# Altium schematic sheet datalogger.SchDoc: Datalogger
size A4; Title2: Datalogger; ENG_APP_DATE: --/--/--; DSN_APP_DATE: --/--/--; CHK_APP_DATE: --/--/--; Date: *******; ApprovedBy: *******; CheckedBy: None; Author: *******; CompanyName: *******; Engineer: *******; Organization: *******; Address1: *******; Address2: *******; Address3: *******; Address4: *******; DocumentNumber: Doc Num; Revision: *******; SheetNumber: 1; SheetTotal: 7; CurrentTime: *******; CurrentDate: *******; Time: *******; DocumentFullPathAndName: *******; DocumentName: *******; ModifiedDate: *******; ImagePath: *******; ProjectName: *******; Application_BuildNumber: *******
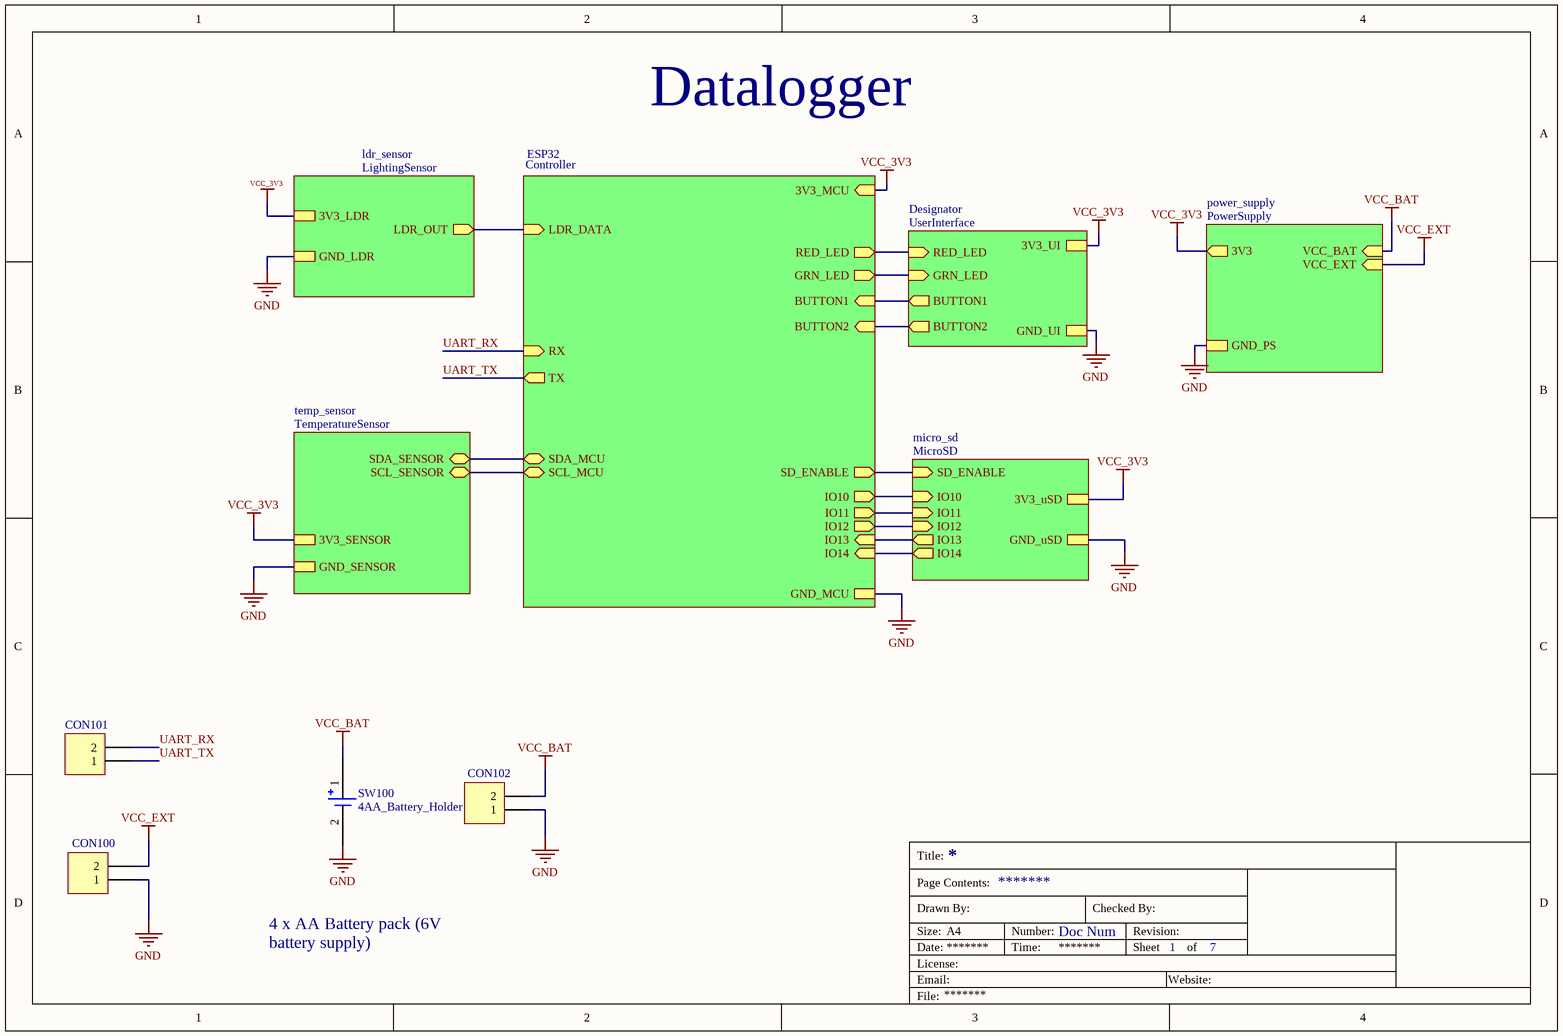
[diagram p0: datalogger.SchDoc]

## Parts
CON100  PIN HEADER 2POS  [FP-TSW-102-07-G-S-MFG]  (value not drawn)
CON101  PIN HEADER 2POS  [FP-TSW-102-07-G-S-MFG]  (value not drawn)
CON102  PIN HEADER 2POS  [FP-TSW-102-07-G-S-MFG]  (value not drawn)
SW100  4AA_Battery_Holder  [4AAA_BATTERY_HOLDER]

## Sub-sheets
Designator = UserInterface: GRN_LED (in), BUTTON1 (out), BUTTON2 (out), RED_LED (in), 3V3_UI, GND_UI
ESP32 = Controller: 3V3_MCU (in), SDA_MCU (bidir), SCL_MCU (bidir), LDR_DATA (in), GND_MCU, TX (out), RX (in), SD_ENABLE (out), GRN_LED (out), BUTTON1 (in), BUTTON2 (in), RED_LED (out), IO10 (out), IO11 (out), IO12 (out), IO13 (in), IO14 (in)
ldr_sensor = LightingSensor: 3V3_LDR, GND_LDR, LDR_OUT (out)
micro_sd = MicroSD: IO10 (in), IO11 (in), IO12 (in), IO13 (out), 3V3_uSD, GND_uSD, SD_ENABLE (in), IO14 (out)
power_supply = PowerSupply: VCC_BAT (in), VCC_EXT (in), 3V3 (out), GND_PS
temp_sensor = TemperatureSensor: SDA_SENSOR (bidir), SCL_SENSOR (bidir), 3V3_SENSOR, GND_SENSOR

## Nets
GND: CON100.1 CON102.1 SW100.2 ; sheet ESP32/GND_MCU, sheet power_supply/GND_PS, sheet temp_sensor/GND_SENSOR, sheet ldr_sensor/GND_LDR, sheet micro_sd/GND_uSD, sheet Designator/GND_UI
VCC_3V3: sheet ESP32/3V3_MCU, sheet power_supply/3V3, sheet temp_sensor/3V3_SENSOR, sheet ldr_sensor/3V3_LDR, sheet micro_sd/3V3_uSD, sheet Designator/3V3_UI
VCC_BAT: CON102.2 SW100.1 ; sheet power_supply/VCC_BAT
VCC_EXT: CON100.2 ; sheet power_supply/VCC_EXT
UART_RX: CON101.2 ; sheet ESP32/RX
UART_TX: CON101.1 ; sheet ESP32/TX
(unnamed): sheet ESP32/SDA_MCU, sheet temp_sensor/SDA_SENSOR
(unnamed): sheet ESP32/SCL_MCU, sheet temp_sensor/SCL_SENSOR
(unnamed): sheet ESP32/LDR_DATA, sheet ldr_sensor/LDR_OUT
(unnamed): sheet ESP32/SD_ENABLE, sheet micro_sd/SD_ENABLE
(unnamed): sheet ESP32/GRN_LED, sheet Designator/GRN_LED
(unnamed): sheet ESP32/BUTTON1, sheet Designator/BUTTON1
(unnamed): sheet ESP32/BUTTON2, sheet Designator/BUTTON2
(unnamed): sheet ESP32/RED_LED, sheet Designator/RED_LED
(unnamed): sheet ESP32/IO10, sheet micro_sd/IO10
(unnamed): sheet ESP32/IO11, sheet micro_sd/IO11
(unnamed): sheet ESP32/IO12, sheet micro_sd/IO12
(unnamed): sheet ESP32/IO13, sheet micro_sd/IO13
(unnamed): sheet ESP32/IO14, sheet micro_sd/IO14

## Notes on the sheet
- 4 x AA Battery pack (6V battery supply)
- Title:
- Drawn By:
- Page Contents:
- Checked By:
- Size:
- Date:
- File:
- License:
- Email:
- A4
- Number:
- Time:
- Revision:
- Sheet
- Website:
- of

## Library data of the parts
CON100-CON102 = CMP-002-00076-1: Conn Unshrouded Header HDR 2 POS 2.54mm Solder ST Top Entry Thru-Hole Bulk; Manufacturer Part Number: TSW-102-07-G-S; Gender: Male; Connector Type: Male Pin; Max Current Rating: 7.6A; Number of Contacts: 2; Max Voltage Rating (AC): 550V; Length: 5.08mm; Depth: 2.54mm; Orientation: Straight; Termination: Solder; Packaging: Bulk; Number of Rows: 1; Contact Material: Bronze; Housing Color: Black; Pitch: 2.54mm; Contact Mating Length: 0.23inch; RoHS Compliant: Yes; Lead Free: Lead Free; Contact Type: Male Pin; Series: TSW; Contact Plating: Gold; Color: Black; Min Operating Temperature: -55°C; REACH SVHC: No SVHC; Housing Material: Polyester; Number of Positions: 2; Mount: Through Hole; Package Quantity: 1; Max Operating Temperature: 125°C
SW100 = 4AAA_battery_holder: Enclosure; Accessory; Battery Holder; Polypropylene; 26ga. 6in Leads; 4-AA; 4 * AA Battery Electronic Plastic Battery Case Storage Shell Box Holder with Wire Leads; Manufacturer: Bud Industries; Manufacturer Part Number: HH-3633; Number of Cells: 4; Supplier 1: Newark; RoHS: Yes; Category: Batteries and Accessories; Stock 1: 555; Pricing 1: 1=3,20000, 10=3,07000, 25=2,94000, 50=2,80000, 100=2,67000, 250=2,40000 (USD); Mount: Chassis; Material: PP,Polypropylene; Body Material: Polypropylene; Weight: 0.43oz; Color: Black; Package Quantity: 1; Termination: Wire Leads; Number of Batteries: 4; REACH SVHC: Unknown; Lead Free: Lead Free; ComponentLink1URL: https://datasheet.ciiva.com/4628/hb3633-36618-4628665.pdf?src-supplier=Mouser; ComponentLink1Description: https://datasheet.ciiva.com/4628/hb3633-36618-4628665.pdf?src-supplier=Mouser; ComponentLink2URL: https://datasheet.ciiva.com/16495/hb3633-16495410.pdf?src-supplier=Future+Electronics; ComponentLink2Description: https://datasheet.ciiva.com/16495/hb3633-16495410.pdf?src-supplier=Future+Electronics; ComponentLink3URL: https://datasheet.ciiva.com/1438/1807993-1438161.pdf?src-supplier=Newark; ComponentLink3Description: https://datasheet.ciiva.com/1438/1807993-1438161.pdf?src-supplier=Newark; Supplier Part Number 1: 34M2187